# Altium schematic sheet AFE.SchDoc
size A; SheetNumber: 4; SheetTotal: 8
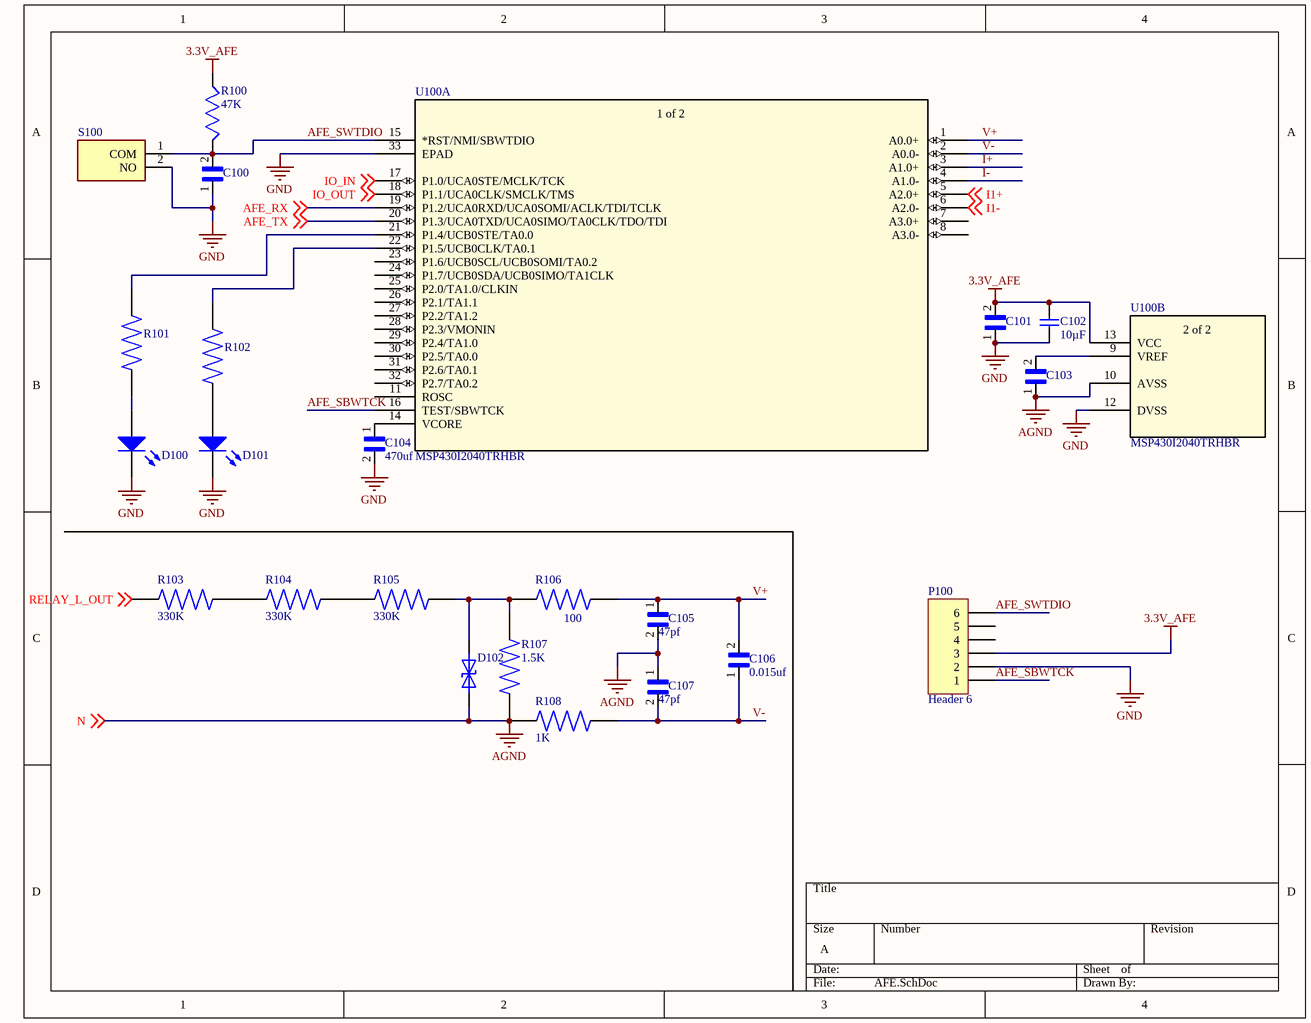
[diagram p0: AFE.SchDoc]

## Parts
C100  06033G104ZAT4A  [CAPC1608X90N]  (value not drawn)
C101  06033G104ZAT4A  [CAPC1608X90N]  (value not drawn)
C102  10µF  [CAP_0603 - duplicate]
C103  06033G104ZAT4A  [CAPC1608X90N]  (value not drawn)
C104  value 470uf  [CAPC1608X90]  (hidden comment: C0603C474K8PACTU)
C105  value 47pf  [CAPC1608X90]  (hidden comment: CC0603JRNPO9BN470)
C106  value 0.015uf  [CAPC1608X87N]  (hidden comment: VJ0603Y153KXAPW1BC)
C107  value 47pf  [CAPC1608X90]  (hidden comment: CC0603JRNPO9BN470)
D100  LED-BLUE  [LED-0603-BLUE]  (value not drawn)
D101  LED-BLUE  [LED-0603-BLUE]  (value not drawn)
D102  SMAJ5.0CA-13-F  [DIOM5126X229N]  (value not drawn)
P100  Header 6  [HDR1X6 - duplicate]
R100  value 47K  [RESC1608X55 - duplicate]  (hidden comment: RC0603FR-0747KL)
R101  SR0603KR-7W270RL  [RESC1608X55 - duplicate]  (value not drawn)
R102  SR0603KR-7W270RL  [RESC1608X55 - duplicate]  (value not drawn)
R103  value 330K  [RESC6331X70N]  (hidden comment: CRCW2512330KFKEG)
R104  value 330K  [RESC6331X70N]  (hidden comment: CRCW2512330KFKEG)
R105  value 330K  [RESC6331X70N]  (hidden comment: CRCW2512330KFKEG)
R106  value 100  [RESC1608X55N - duplicate]  (hidden comment: CR0603-FX-1000ELF)
R107  value 1.5K  [RESC6331X70N]  (hidden comment: CRCW25121K50JNEG)
R108  value 1K  [RESC1608X55N - duplicate]  (hidden comment: CR0603-FX-1001ELF)
S100  PTS636_SM43_SMTR_LFS  [PTS636SM43SMTRLFS - duplicate]  (value not drawn)
U100  MSP430I2040TRHBR  [RHB32_TEX]  (parts A,B of 2)

## Nets
3.3V_AFE: C101.2 C102.1 P100.3 R100.2 U100.13(VCC)
AGND: C103.1 C105.2 C107.1 D102.2 R107.1 R108.1 U100.10(AVSS) ; off-sheet N  [also labelled N]
GND: C100.1 C101.1 C102.2 C104.2 D100.2(K) D101.2(K) P100.2 S100.2(NO) U100.12(DVSS) U100.33(EPAD)
AFE_RX: U100.19(P1.2/UCA0RXD/UCA0SOMI/ACLK/TDI/TCLK) ; off-sheet AFE_RX
AFE_SBWTCK: P100.1 U100.16(TEST/SBWTCK)
AFE_SWTDIO: C100.2 P100.6 R100.1 S100.1(COM) U100.15(*RST/NMI/SBWTDIO)
AFE_TX: U100.20(P1.3/UCA0TXD/UCA0SIMO/TA0CLK/TDO/TDI) ; off-sheet AFE_TX
I1+: U100.5(A2.0+) ; off-sheet I1+
I1-: U100.6(A2.0-) ; off-sheet I1-
I+: U100.3(A1.0+)
I-: U100.4(A1.0-)
IO_IN: U100.17(P1.0/UCA0STE/MCLK/TCK) ; off-sheet IO_IN
IO_OUT: U100.18(P1.1/UCA0CLK/SMCLK/TMS) ; off-sheet IO_OUT
RELAY_L_OUT: R103.1 ; off-sheet RELAY_L_OUT
V+: C105.1 C106.2 R106.2 U100.1(A0.0+)
V-: C106.1 C107.2 R108.2 U100.2(A0.0-)
NetC103_2: C103.2 U100.9(VREF)
NetC104_1: C104.1 U100.14(VCORE)
NetD100_1: D100.1(A) R101.1
NetD101_1: D101.1(A) R102.1
NetD102_1: D102.1 R105.2 R106.1 R107.2
NetR101_2: R101.2 U100.21(P1.4/UCB0STE/TA0.0)
NetR102_2: R102.2 U100.22(P1.5/UCB0CLK/TA0.1)
NetR103_2: R103.2 R104.1
NetR104_2: R104.2 R105.1

Not connected (* = marked no-connect by the designer): P100 4 5; U100 7(A3.0+) 8(A3.0-) 11(ROSC) 23(P1.6/UCB0SCL/UCB0SOMI/TA0.2) 24(P1.7/UCB0SDA/UCB0SIMO/TA1CLK) 25(P2.0/TA1.0/CLKIN) 26(P2.1/TA1.1) 27(P2.2/TA1.2) 28(P2.3/VMONIN) 29(P2.4/TA1.0) 30(P2.5/TA0.0) 31(P2.6/TA0.1) 32(P2.7/TA0.2)

## Notes on the sheet
- (in symbol MSP430I2040TRHBR, part A) 1 of 2
- (in symbol MSP430I2040TRHBR, part B) 2 of 2

## Library data of the parts
C100 C101 C103 = 06033G104ZAT4A: Cap Ceramic 0.1uF 25V Y5V -20% to 80% SMD 0603 85C T/R; MF: {'manufacturer': u'AVX'}; Availability: Unavailable; MP: 06033G104ZAT4A; Price: None; Package: None; Value: *
C102 = CL10A106KP8NNNC: 10µF 10V Ceramic Capacitor X5R 0603 (1608 Metric) 0.063" L x 0.031" W (1.60mm x 0.80mm); Manufacturer: Samsung Electronics; Supplier 1: Digi-Key; Value: 10µF; Supplier Part Number 1: 1276-1192-1-ND; Part Number: CL10A106KP8NNNC
C104 = C0603C474K8PACTU: CAP, MLCC, X5R, 0.47UF, 10V, 0603; MF: {'manufacturer': u'KEMET'}; Availability: Unavailable; MP: C0603C474K8PACTU; Price: None; Package: None
C105 C107 = CC0603JRNPO9BN470: CAP CER 47PF 50V C0G/NPO 0603; MF: {'manufacturer': u'Yageo'}; MP: CC0603JRNPO9BN470; Package: None; Price: None; Availability: Unavailable
C106 = VJ0603Y153KXAPW1BC: VJ_W1BC; MF: {'manufacturer': u'Vishay Vitramon'}; MP: VJ0603Y153KXAPW1BC; Availability: Unavailable; Package: None; Price: None
D100 D101 = LTST-C193TBKT-5A: Blue 470nm LED Indication - Discrete 2.8V 0603 (1608 Metric); Manufacturer: Lite-On; Part Number: LTST-C193TBKT-5A; Value: LED-BLUE; Supplier 1: Digi-Key; Supplier Part Number 1: 160-1827-1-ND
D102 = SMAJ5.0CA-13-F: 9.2V Clamp 43.5A Ipp Tvs Diode Surface Mount SMA (DO-214AC); MF: {'manufacturer': u'Diodes Inc.'}; Availability: Unavailable; MP: SMAJ5.0CA-13-F; Price: None; Package: None; Value: *
P100 = Header 6: Header, 6-Pin; LatestRevisionDate: 17-Jul-2002; LatestRevisionNote: Re-released for DXP Platform.; Publisher: Altium Limited
R100 = RC0603FR-0747KL: RC Series 0603 0.1 W 47 kOhms 1% Â±100 ppm/Â°C SMT Thick Film Chip Resistor; MF: {'manufacturer': u'Yageo'}; MP: RC0603FR-0747KL; Package: None; Price: None; Availability: Unavailable
R101 R102 = SR0603KR-7W270RL: MF: {'manufacturer': u'Yageo'}; Package: None; Price: None; Value: *; MP: SR0603KR-7W270RL; Availability: Unavailable
R103-R105 = CRCW2512330KFKEG: MF: {'manufacturer': u'Vishay'}; MP: CRCW2512330KFKEG; Availability: Unavailable; Package: None; Price: None
R106 = CR0603-FX-1000ELF: SMD 0603 thick film resistor 100R 1%; MF: {'manufacturer': u'Bourns'}; Availability: Unavailable; Price: None; MP: CR0603-FX-1000ELF; Package: None
R107 = CRCW25121K50JNEG: MF: {'manufacturer': u'Vishay'}; MP: CRCW25121K50JNEG; Package: None; Price: None; Availability: Unavailable
R108 = CR0603-FX-1001ELF: Resistor; Thick Film; Res 1 Kilohms; Pwr-Rtg 0.1 W; Tol 1%; SMT; 0603; MF: {'manufacturer': u'Bourns'}; Availability: Unavailable; MP: CR0603-FX-1001ELF; Price: None; Package: None
S100 = PTS636_SM43_SMTR_LFS: Switch; Manufacturer_Name: C & K COMPONENTS; Manufacturer_Part_Number: PTS636 SM43 SMTR LFS; Datasheet Link: https://componentsearchengine.com/Datasheets/1/PTS636 SM43 SMTR LFS.pdf; Height: 4.5mm; Mouser Part Number: 611-PTS636SM43SMTRLF; Mouser Price/Stock: https://www.mouser.co.uk/ProductDetail/CK/PTS636-SM43-SMTR-LFS?qs=vLWxofP3U2xu5raMGkTmHg%3D%3D; Arrow Part Number: PTS636 SM43 SMTR LFS; Arrow Price/Stock: https://www.arrow.com/en/products/pts636-sm43-smtr-lfs/ck
U100 = MSP430I2040TRHBR: No Description Available; Mfr_Name: Texas Instruments; Copyright: Copyright (C) 2022 Ultra Librarian. All rights reserved.; Manufacturer_Part_Number: MSP430I2040TRHBR; RefDes: RefDes; Type: DEV